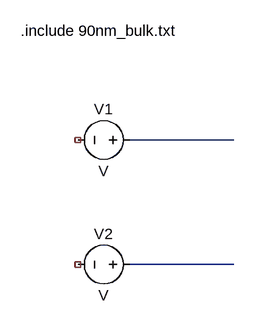
[diagram p0: schematic NAND.asc]
NAND.asc, the LTspice schematic file:
Version 4
SHEET 1 880 680
WIRE 80 224 -80 224
WIRE 80 416 -80 416
SYMBOL voltage -64 224 R90
WINDOW 0 -32 56 VBottom 2
WINDOW 3 32 56 VTop 2
SYMATTR InstName V1
SYMBOL voltage -64 416 R90
WINDOW 0 -32 56 VBottom 2
WINDOW 3 32 56 VTop 2
SYMATTR InstName V2
TEXT -248 56 Left 2 !.include 90nm_bulk.txt

The netlist it stands for:
* NAND.asc
V1 N001 NC_01 V
V2 N002 NC_02 V
.include 90nm_bulk.txt
.backanno
.end